# Altium project Tube03.PrjPCB
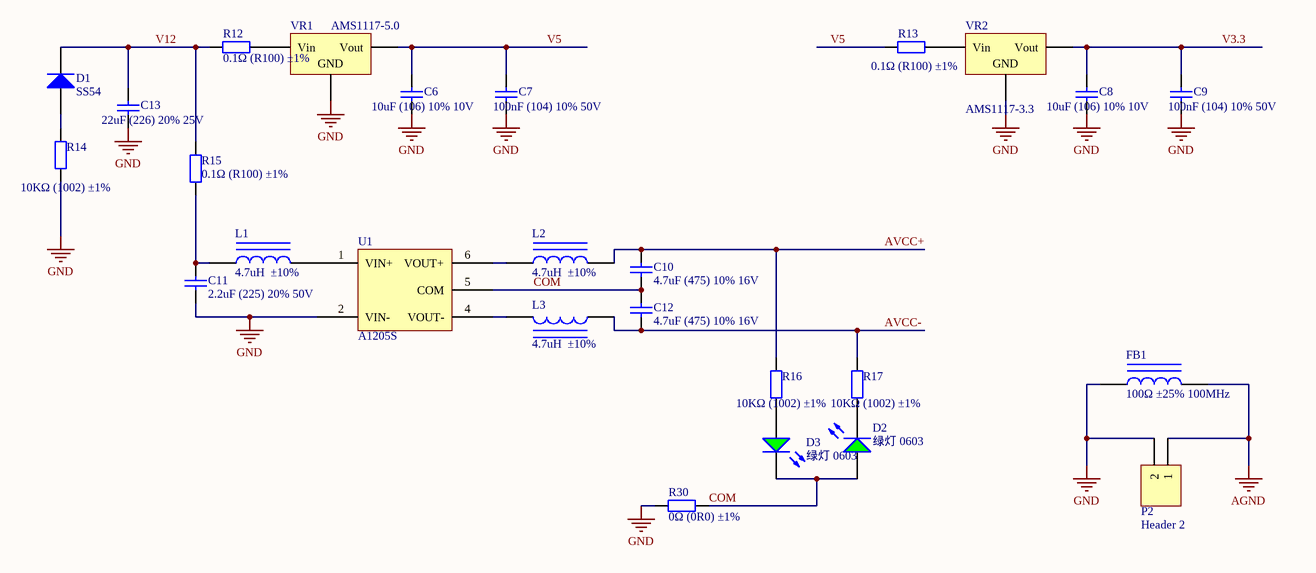
[diagram p0: Power.SchDoc]
2 sheets, 52 parts. Net scope: global (net labels, ports and power ports of the same name join across sheets).
Board file: Tube03.PcbDoc
Sheets:
  Power.SchDoc
  Amp.SchDoc

## Sheet Power.SchDoc
size A4

### Parts
C6  10uF (106) 10% 10V  [0603_C]
C7  100nF (104) 10% 50V  [0603_C]
C8  10uF (106) 10% 10V  [0603_C]
C9  100nF (104) 10% 50V  [0603_C]
C10  4.7uF (475) 10% 16V  [0603_C]
C11  2.2uF (225) 20% 50V  [0805_C]
C12  4.7uF (475) 10% 16V  [0603_C]
C13  22uF (226) 20% 25V  [0805_C]
D1  SS54  [SMA(DO-214AC)_S1]
D2  绿灯 0603  [0603_LED_S1]
D3  绿灯 0603  [0603_LED_S1]
FB1  100Ω ±25% 100MHz  [0805_L]
L1  4.7uH  ±10%  [1206_L]
L2  4.7uH  ±10%  [1206_L]
L3  4.7uH  ±10%  [1206_L]
P2  Header 2  [HDR1X2]
R12  0.1Ω (R100) ±1%  [1206_R]
R13  0.1Ω (R100) ±1%  [1206_R]
R14  10KΩ (1002) ±1%  [0805_R]
R15  0.1Ω (R100) ±1%  [1206_R]
R16  10KΩ (1002) ±1%  [0603_R]
R17  10KΩ (1002) ±1%  [0603_R]
R30  0Ω (0R0) ±1%  [1206_R]
U1  A1205S  [A1205S]
VR1  AMS1117-5.0  [SOT-223]
VR2  AMS1117-3.3  [SOT-223]

### Nets
AGND: FB1.2 P2.1
GND: C6.1 C7.1 C8.1 C9.1 C11.1 C13.1 FB1.1 P2.2 R14.1 R30.1 U1.2(VIN-) VR1.1(GND) VR2.1(GND)
AVCC+: C10.2 L2.2 R16.2
AVCC-: C12.1 L3.2 R17.2
COM: C10.1 C12.2 D2.A D3.K R30.2 U1.5(COM)
V3.3: C8.2 C9.2 VR2.2(Vout)
V5: C6.2 C7.2 R13.1 VR1.2(Vout)
V12: C13.2 D1.2(K) R12.1 R15.2
NetC11_2: C11.2 L1.1 R15.1
NetD1_1: D1.1(A) R14.2
NetD2_K: D2.K R17.1
NetD3_A: D3.A R16.1
NetL1_2: L1.2 U1.1(VIN+)
NetL2_1: L2.1 U1.6(VOUT+)
NetL3_1: L3.1 U1.4(VOUT-)
NetR12_2: R12.2 VR1.3(Vin)
NetR13_2: R13.2 VR2.3(Vin)

### Library data of the parts
C6 C8 = 0603 10uF (106) 10% 10V: 贴片电容; ComponentLink1Description: 供应商链接; ComponentLink1URL: http://www.szlcsc.com/product/details_20411.html; Package: 0603; Supplier: LC; SuppliersPartNumber: C19702
C7 C9 = 0603 100nF (104) 10% 50V: 贴片电容; ComponentLink1Description: 供应商链接; ComponentLink1URL: http://www.szlcsc.com/product/details_15331.html; Package: 0603; Supplier: LC; SuppliersPartNumber: C14663
C10 C12 = 0603 4.7uF (475) 10% 16V: 贴片电容; ComponentLink1Description: 供应商链接; ComponentLink1URL: http://www.szlcsc.com/product/details_20375.html; Package: 0603; Supplier: LC; SuppliersPartNumber: C19666
C11 = 0805 2.2uF (225) 20% 50V: 贴片电容; ComponentLink1Description: 供应商链接; ComponentLink1URL: http://www.szlcsc.com/product/details_50225.html; Package: 0805; Supplier: LC; SuppliersPartNumber: C49217
C13 = 0805 22uF (226) 20% 25V: 贴片电容; ComponentLink1Description: 供应商链接; ComponentLink1URL: http://www.szlcsc.com/product/details_46786.html; Package: 0805; Supplier: LC; SuppliersPartNumber: C45783
D1 = SMA(DO-214AC) SS54: 二极管; ComponentLink1Description: 供应商链接; ComponentLink1URL: http://www.szlcsc.com/product/details_23178.html; Package: SMA(DO-214AC); Supplier: LC; SuppliersPartNumber: C22452
D2 D3 = 0603 绿灯: 发光二极管; ComponentLink1Description: 供应商链接; ComponentLink1URL: http://www.szlcsc.com/product/details_73152.html; Package: 0603; Supplier: LC; SuppliersPartNumber: C72043
FB1 = 0805 100Ω 25% 100MHz: 贴片磁珠; ComponentLink1Description: 供应商链接; ComponentLink1URL: http://www.szlcsc.com/product/details_1367.html; Package: 0805; Supplier: LC; SuppliersPartNumber: C1015
L1-L3 = 1206 4.7uH  10%: 贴片电感; ComponentLink1Description: 供应商链接; ComponentLink1URL: http://www.szlcsc.com/product/details_1401.html; Package: 1206; Supplier: LC; SuppliersPartNumber: C1049
P2 = Header 2: Header, 2-Pin; LatestRevisionDate: 17-Jul-2002; LatestRevisionNote: Re-released for DXP Platform.; Publisher: Altium Limited
R12 R13 R15 = 1206 0.1Ω (R100) 1%: 贴片电阻; ComponentLink1Description: 供应商链接; ComponentLink1URL: http://www.szlcsc.com/product/details_26077.html; Package: 1206; Supplier: LC; SuppliersPartNumber: C25334
R14 = 0805 10KΩ (1002) 1%: 贴片电阻; ComponentLink1Description: 供应商链接; ComponentLink1URL: http://www.szlcsc.com/product/details_18102.html; Package: 0805; Supplier: LC; SuppliersPartNumber: C17414
R16 R17 = 0603 10KΩ (1002) 1%: 贴片电阻; ComponentLink1Description: 供应商链接; ComponentLink1URL: http://www.szlcsc.com/product/details_26547.html; Package: 0603; Supplier: LC; SuppliersPartNumber: C25804
R30 = 1206 0Ω (0R0) 1%: 贴片电阻; ComponentLink1Description: 供应商链接; ComponentLink1URL: http://www.szlcsc.com/product/details_18576.html; Package: 1206; Supplier: LC; SuppliersPartNumber: C17888
VR1 = SOT-223 AMS1117-5.0: 低压差线性稳压(LDO); ComponentLink1Description: 供应商链接; ComponentLink1URL: http://www.szlcsc.com/product/details_6653.html; Package: SOT-223; Supplier: LC; SuppliersPartNumber: C6187
VR2 = SOT-223 AMS1117-3.3: 低压差线性稳压(LDO); ComponentLink1Description: 供应商链接; ComponentLink1URL: http://www.szlcsc.com/product/details_6652.html; Package: SOT-223; Supplier: LC; SuppliersPartNumber: C6186

## Sheet Amp.SchDoc
size A4
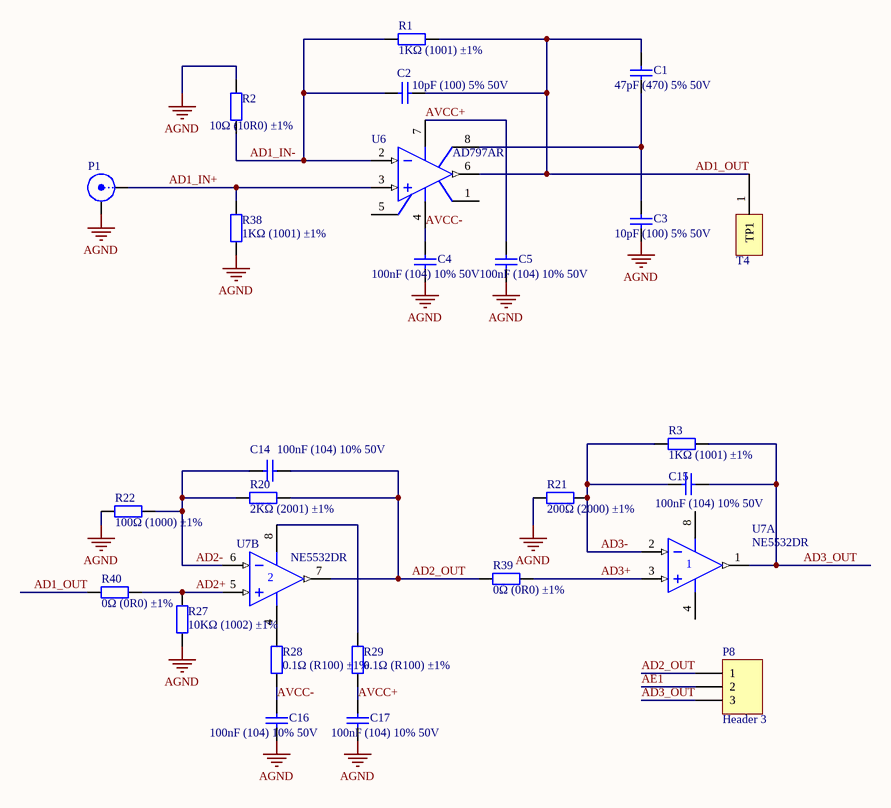
[diagram p1: Amp.SchDoc]

### Parts
C1  47pF (470) 5% 50V  [0603_C]
C2  10pF (100) 5% 50V  [0603_C]
C3  10pF (100) 5% 50V  [0603_C]
C4  100nF (104) 10% 50V  [0603_C]
C5  100nF (104) 10% 50V  [0603_C]
C14  100nF (104) 10% 50V  [0603_C]
C15  100nF (104) 10% 50V  [0603_C]
C16  100nF (104) 10% 50V  [0603_C]
C17  100nF (104) 10% 50V  [0603_C]
P1  SMB  [SMB_V-RJ45]  (value not drawn)
P8  Header 3  [HDR1X3]
R1  1KΩ (1001) ±1%  [0603_R]
R2  10Ω (10R0) ±1%  [0603_R]
R3  1KΩ (1001) ±1%  [0603_R]
R20  2KΩ (2001) ±1%  [0603_R]
R21  200Ω (2000) ±1%  [0603_R]
R22  100Ω (1000) ±1%  [0603_R]
R27  10KΩ (1002) ±1%  [0603_R]
R28  0.1Ω (R100) ±1%  [1206_R]
R29  0.1Ω (R100) ±1%  [1206_R]
R38  1KΩ (1001) ±1%  [0603_R]
R39  0Ω (0R0) ±1%  [0603_R]
R40  0Ω (0R0) ±1%  [0603_R]
T4  TP1  [TP1]  (value not drawn)
U6  AD797AR  [SO-8C_N]
U7  NE5532DR  [SOIC-8_150mil]  (parts A,B of 2)

### Nets
AGND: C3.1 C4.1 C5.1 C16.1 C17.1 P1.2(Y) R2.2 R21.1 R22.1 R27.1 R38.1
AD1_IN+: P1.1(X) R38.2 U6.3(IN+)
AD1_IN-: C2.2 R1.2 R2.1 U6.2(IN-)
AD1_OUT: C1.2 C2.1 R1.1 R40.1 T4.1(TP1) U6.6(OUT)
AD2+: R27.2 R40.2 U7.5(IN+)
AD2-: C14.1 R20.1 R22.2 U7.6(IN-)
AD2_OUT: C14.2 P8.1 R20.2 R39.1 U7.7(OUT)
AD3+: R39.2 U7.3(IN+)
AD3-: C15.1 R3.1 R21.2 U7.2(IN-)
AD3_OUT: C15.2 P8.3 R3.2 U7.1(OUT)
AE1: P8.2
AVCC+: C5.2 C17.2 R29.1 U6.7(V+)
AVCC-: C4.2 C16.2 R28.1 U6.4(V-)
NetC1_1: C1.1 C3.2 U6.8(DECMPEN)
NetR28_2: R28.2 U7.4(V-)
NetR29_2: R29.2 U7.8(V+)

Not connected (* = marked no-connect by the designer): U6 1(OS_NUL) 5(OS_NUL)

### Library data of the parts
C1 = 0603 47pF (470) 5% 50V: 贴片电容; ComponentLink1Description: 供应商链接; ComponentLink1URL: http://www.szlcsc.com/product/details_2023.html; Package: 0603; Supplier: LC; SuppliersPartNumber: C1671
C2 C3 = 0603 10pF (100) 5% 50V: 贴片电容; ComponentLink1Description: 供应商链接; ComponentLink1URL: http://www.szlcsc.com/product/details_1986.html; Package: 0603; Supplier: LC; SuppliersPartNumber: C1634
C4 C5 C14-C17 = 0603 100nF (104) 10% 50V: 贴片电容; ComponentLink1Description: 供应商链接; ComponentLink1URL: http://www.szlcsc.com/product/details_15331.html; Package: 0603; Supplier: LC; SuppliersPartNumber: C14663
P1 = SMB: SMB Straight Connector; LatestRevisionDate: 17-Jul-2002; LatestRevisionNote: Re-released for DXP Platform.; Publisher: Altium Limited
P8 = Header 3: Header, 3-Pin; LatestRevisionDate: 17-Jul-2002; LatestRevisionNote: Re-released for DXP Platform.; Publisher: Altium Limited
R1 R3 R38 = 0603 1KΩ (1001) 1%: 贴片电阻; ComponentLink1Description: 供应商链接; ComponentLink1URL: http://www.szlcsc.com/product/details_21904.html; Package: 0603; Supplier: LC; SuppliersPartNumber: C21190
R2 = 0603 10Ω (10R0) 1%: 贴片电阻; ComponentLink1Description: 供应商链接; ComponentLink1URL: http://www.szlcsc.com/product/details_23586.html; Package: 0603; Supplier: LC; SuppliersPartNumber: C22859
R20 = 0603 2KΩ (2001) 1%: 贴片电阻; ComponentLink1Description: 供应商链接; ComponentLink1URL: http://www.szlcsc.com/product/details_23702.html; Package: 0603; Supplier: LC; SuppliersPartNumber: C22975
R21 = 0603 200Ω (2000) 1%: 贴片电阻; ComponentLink1Description: 供应商链接; ComponentLink1URL: http://www.szlcsc.com/product/details_8708.html; Package: 0603; Supplier: LC; SuppliersPartNumber: C8218
R22 = 0603 100Ω (1000) 1%: 贴片电阻; ComponentLink1Description: 供应商链接; ComponentLink1URL: http://www.szlcsc.com/product/details_23502.html; Package: 0603; Supplier: LC; SuppliersPartNumber: C22775
R27 = 0603 10KΩ (1002) 1%: 贴片电阻; ComponentLink1Description: 供应商链接; ComponentLink1URL: http://www.szlcsc.com/product/details_26547.html; Package: 0603; Supplier: LC; SuppliersPartNumber: C25804
R28 R29 = 1206 0.1Ω (R100) 1%: 贴片电阻; ComponentLink1Description: 供应商链接; ComponentLink1URL: http://www.szlcsc.com/product/details_26077.html; Package: 1206; Supplier: LC; SuppliersPartNumber: C25334
R39 R40 = 0603 0Ω (0R0) 1%: 贴片电阻; ComponentLink1Description: 供应商链接; ComponentLink1URL: http://www.szlcsc.com/product/details_21903.html; Package: 0603; Supplier: LC; SuppliersPartNumber: C21189
U6 = AD797AR: Ultra-Low Distortion, Ultra-Low Noise Operational Amplifier; Published: 8-Jun-2000; LatestRevisionDate: 13-Apr-2006; LatestRevisionNote: IPC-7351 Footprint Added.; DatasheetVersion: REV. C; PackageVersion: revC; PackageReference: SO-8C; Publisher: Altium Limited; PackageDescription: 8-Pin Small Outline Integrated Circuit 1.27 mm Pitch; Code_IPC: SOIC127P600-8; ComponentLink1Description: Manufacturer Link; ComponentLink1URL: http://www.analog.com/en/prod/0,,759_786_AD797%2C00.html; ComponentLink2Description: Datasheet; ComponentLink2URL: http://www.analog.com/UploadedFiles/Data_Sheets/507345751AD797_d.pdf
U7 = NE5532DR_[C7426]: 功放; ComponentLink1Description: 供应商链接; ComponentLink1URL: http://www.szlcsc.com/product/details_7903.html; Package: SOIC-8_150mil; Supplier: LC; SuppliersPartNumber: C7426

## Nets that join several sheets
AGND: Power (FB1.2 P2.1), Amp (11 pins)
AVCC+: Power (C10.2 L2.2 R16.2), Amp (C5.2 C17.2 R29.1 U6.7)
AVCC-: Power (C12.1 L3.2 R17.2), Amp (C4.2 C16.2 R28.1 U6.4)